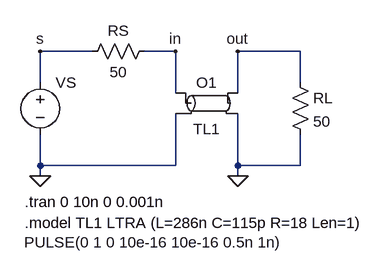
[diagram p0: schematic assig6_exercise2_lossyTL.asc]
assig6_exercise2_lossyTL.asc, the LTspice schematic file:
Version 4
SHEET 1 880 680
WIRE 208 64 128 64
WIRE 336 64 288 64
WIRE 528 64 432 64
WIRE 128 112 128 64
WIRE 528 112 528 64
WIRE 336 128 336 64
WIRE 432 128 432 64
WIRE 128 240 128 192
WIRE 336 240 336 160
WIRE 336 240 128 240
WIRE 432 240 432 160
WIRE 528 240 528 192
WIRE 528 240 432 240
WIRE 128 256 128 240
WIRE 432 256 432 240
FLAG 128 256 0
FLAG 432 256 0
FLAG 336 64 in
FLAG 128 64 s
FLAG 432 64 out
SYMBOL voltage 128 96 R0
WINDOW 123 0 0 Left 0
WINDOW 39 0 0 Left 0
WINDOW 3 -25 262 Left 2
SYMATTR InstName VS
SYMATTR Value PULSE(0 1 0 10e-16 10e-16 0.5n 1n)
SYMBOL res 304 48 R90
WINDOW 0 0 56 VBottom 2
WINDOW 3 32 56 VTop 2
SYMATTR InstName RS
SYMATTR Value 50
SYMBOL res 512 96 R0
SYMATTR InstName RL
SYMATTR Value 50
SYMBOL ltline 384 144 R0
WINDOW 3 0 24 Top 2
SYMATTR Value TL1
SYMATTR InstName O1
TEXT 104 296 Left 2 !.tran 0 10n 0 0.001n
TEXT 104 328 Left 2 !.model TL1 LTRA (L=286n C=115p R=18 Len=1)

The netlist it stands for:
* assig6_exercise2_lossyTL.asc
VS s 0 PULSE(0 1 0 10e-16 10e-16 0.5n 1n)
RS in s 50
RL out 0 50
O1 in 0 out 0 TL1
.tran 0 10n 0 0.001n
.model TL1 LTRA (L=286n C=115p R=18 Len=1)
.backanno
.end